# EasyEDA Pro project RCkid.epro, schematic Devboard, sheets 6 to 7 of 7

## Sheets
6 Connectors: Page Name: Connectors
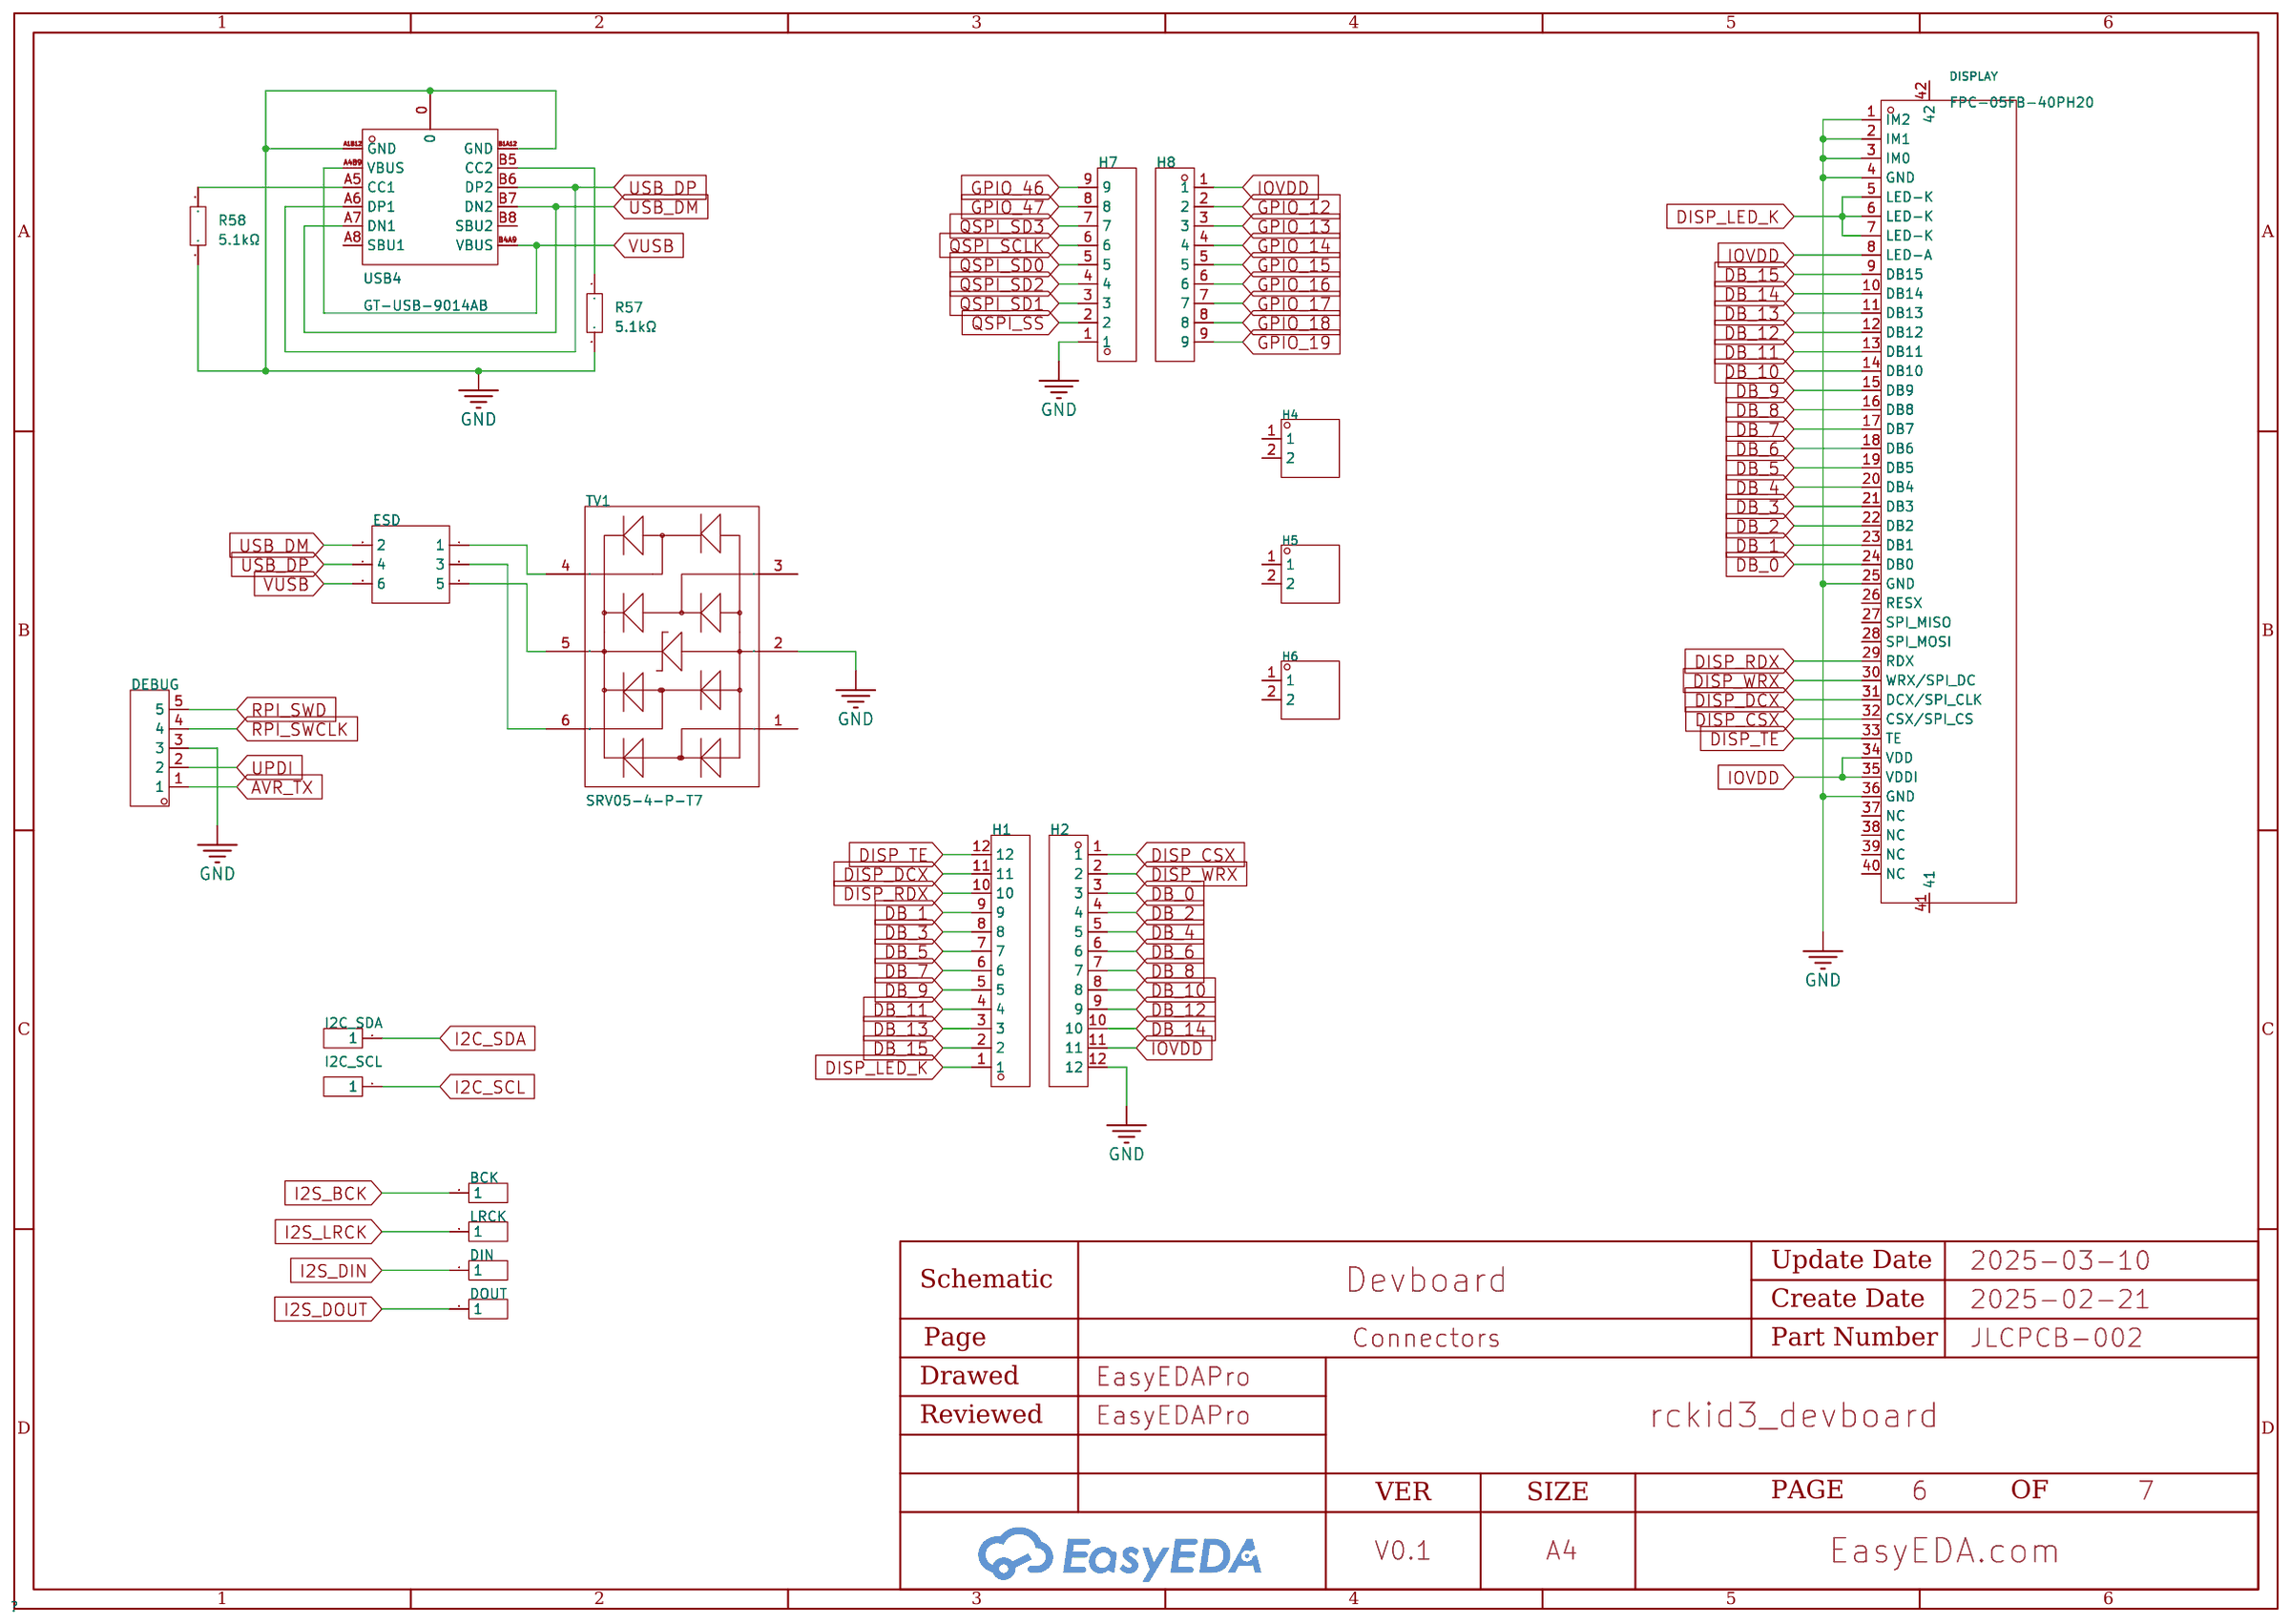
[diagram p20: Connectors]
7 RP2350: Page Name: RP2350; Update Date: 2025-03-01; Version: V1.0
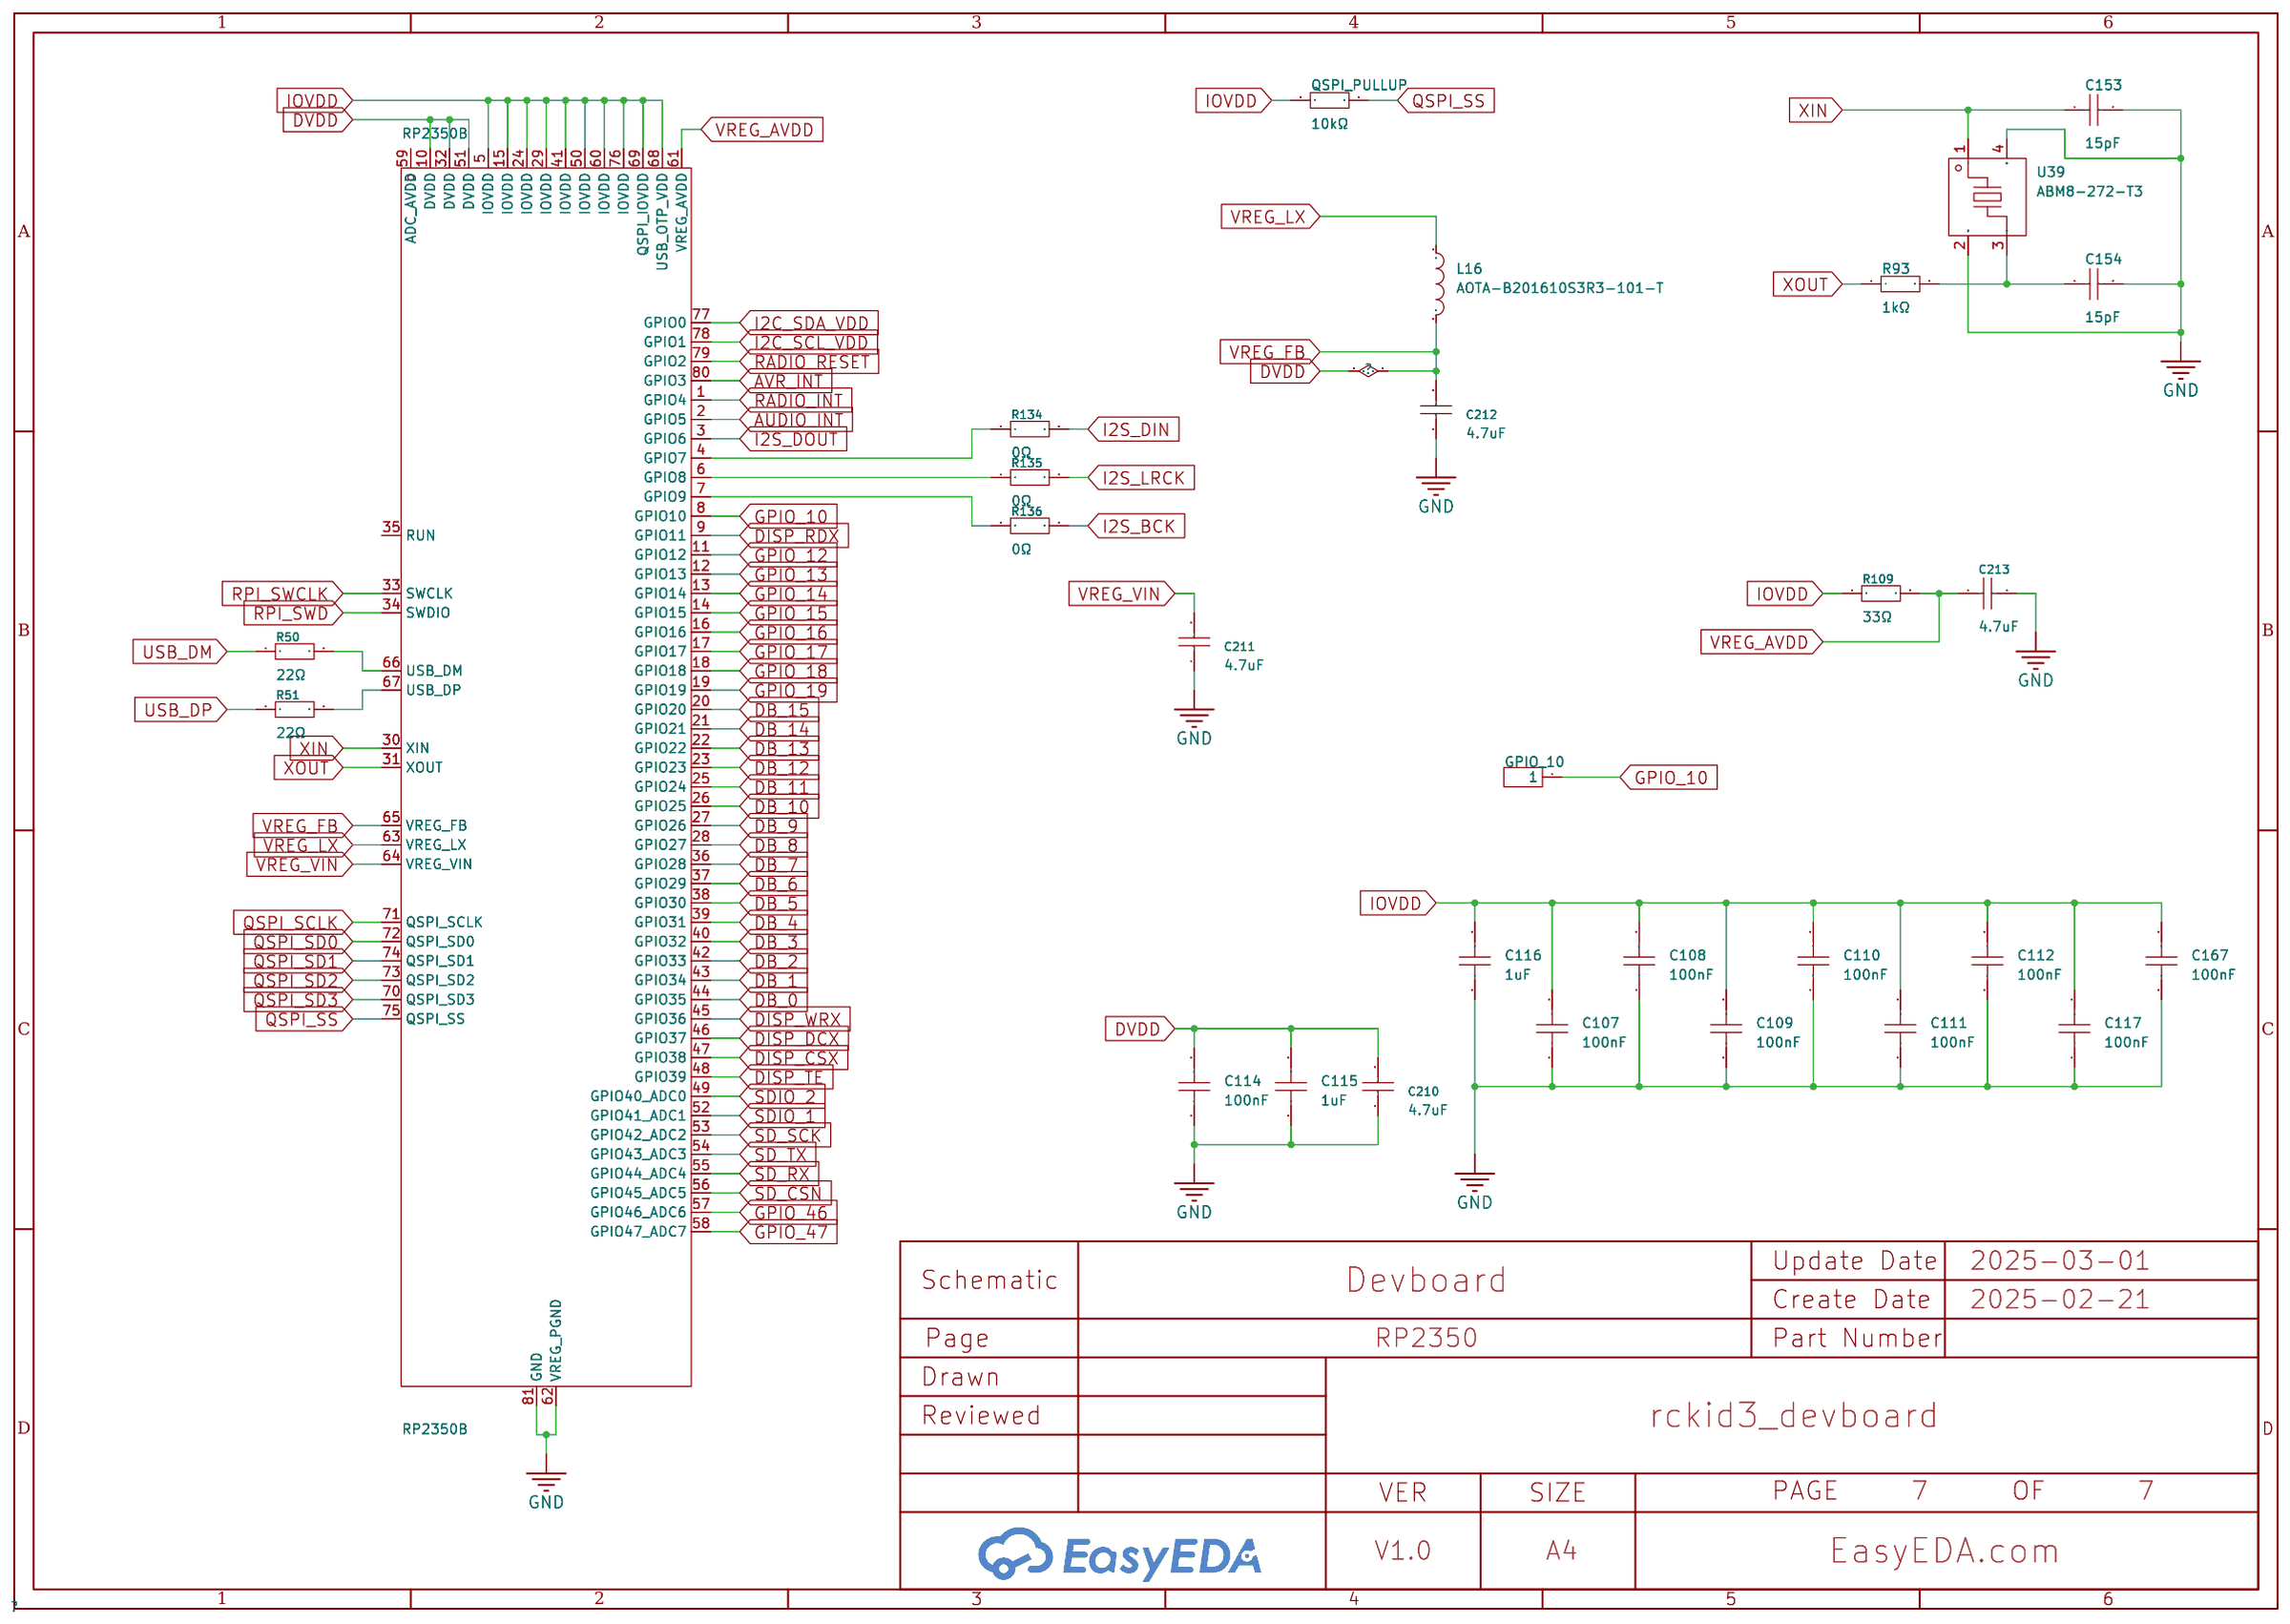
[diagram p21: RP2350]

## Parts
sheet Connectors
BCK  -  [HDR-TH_1P-V-M_XKB_X4611WV-01I-C28D40]
DEBUG  -  [HDR-TH_5P-P2.54-V-M]
DIN  -  [HDR-TH_1P-V-M_XKB_X4611WV-01I-C28D40]
DISPLAY  FPC-05FB-40PH20  [FPC-SMD_40P-P0.50_XUNPU_FPC-05FB-40PH20]
DOUT  -  [HDR-TH_1P-V-M_XKB_X4611WV-01I-C28D40]
ESD  -  [HDR-TH_6P-P2.54-V-F-R2-C3-S2.54]
H1  -  [HDR-TH_12P-P2.54-V-M]
H2  -  [HDR-TH_12P-P2.54-V-M]
H4  -  [HDR-TH_2P-P2.54-V-M-1]
H5  -  [HDR-TH_2P-P2.54-V-M-1]
H6  -  [HDR-TH_2P-P2.54-V-M-1]
H7  -  [HDR-TH_9P-P2.54-V-M]
H8  -  [HDR-TH_9P-P2.54-V-M]
I2C_SCL  -  [HDR-TH_1P-V-M_XKB_X4611WV-01I-C28D40]
I2C_SDA  -  [HDR-TH_1P-V-M_XKB_X4611WV-01I-C28D40]
LRCK  -  [HDR-TH_1P-V-M_XKB_X4611WV-01I-C28D40]
R57  5.1kΩ  [R0402]
R58  5.1kΩ  [R0402]
TV1  SRV05-4-P-T7  [SOT-23-6_L2.9-W1.6-P0.95-LS2.8-BR]
USB4  GT-USB-9014AB  [USB-C-SMD_GT-USB-9014AB]
sheet RP2350
C107  100nF  [C0402]
C108  100nF  [C0402]
C109  100nF  [C0402]
C110  100nF  [C0402]
C111  100nF  [C0402]
C112  100nF  [C0402]
C114  100nF  [C0402]
C115  1uF  [C0402]
C116  1uF  [C0402]
C117  100nF  [C0402]
C153  15pF  [C0402]
C154  15pF  [C0402]
C167  100nF  [C0402]
C210  4.7uF  [C0402]
C211  4.7uF  [C0402]
C212  4.7uF  [C0402]
C213  4.7uF  [C0402]
GPIO_10  -  [HDR-TH_1P-V-M_XKB_X4611WV-01I-C28D40]
L16  AOTA-B201610S3R3-101-T  [IND-SMD_L2.0-W1.6_AOTA-B201610S3R3-101-T]
QSPI_PULLUP  10kΩ  [R0805]
R50  22Ω  [R0402]
R51  22Ω  [R0402]
R93  1kΩ  [R0402]
R109  33Ω  [R0402]
R134  0Ω  [R0805]
R135  0Ω  [R0805]
R136  0Ω  [R0805]
RP2350B  RP2350B  [QFN-80_L10.0-W10.0-P0.40-TL-EP3.4]
U39  ABM8-272-T3  [CRYSTAL-SMD_4P-L3.2-W2.5-BL]

## Library data of the parts
BCK DIN DOUT GPIO_10 I2C_SCL I2C_SDA LRCK = HDR-M_2.54_1x1P: Supplier Footprint: Through
DEBUG = HDR-M_2.54_1x5P: Supplier Footprint: Through
DISPLAY = FPC-05FB-40PH20: Locking Feature:Clamshell Contact Type:Double-sided contacts/up and down connection Number of Contacts:40P Pitch:0.5mm Mounting Type:卧贴 FFC, FCB Thickness:0.3mm FFC, FCB Thickness:0.3mm Height Above Board:2mm Operating Temperature Range:-25℃~+85℃ Operatin; LCSC Part Name: 间距:0.5mm P数:40P 翻盖式 双侧触点/上下接; Supplier Part: C2856837; Manufacturer: XUNPU(讯普); Supplier Footprint: SMD,P=0.5mm,卧贴; JLCPCB Part Class: Extended Part; Datasheet: https://atta.szlcsc.com/upload/public/pdf/source/20210922/C2856837_A0FF02895414764A7F2E525E58748FC4.pdf; Supplier: LCSC; Locking Feature: Clamshell; Contact Type: Double-sided contacts/up and down connection; Number of Contacts: 40P; Pitch: 0.5mm; Mounting Type: 卧贴; FFC, FCB Thickness: 0.3mm; Height Above Board: 2mm; Operating Temperature Range: -25℃~+85℃
ESD = HDR-F-2.54_2x3: Supplier Footprint: Through
H1 H2 = HDR-M_2.54_1x12P: Supplier Footprint: Through
H4-H6 = HDR-M_2.54_1x2P: Supplier Footprint: Through
H7 H8 = HDR-M_2.54-1x9P: Supplier Footprint: Through
R57 R58 = 0402WGF5101TCE: Type:Thick Film Resistors Resistance: Tolerance:±1% Tolerance:±1% Power(Watts): Temperature Coefficient:±100ppm/℃ Temperature Coefficient:±100ppm/℃ Overload Voltage (Max): Operating Temperature Range:-55℃~+155℃ Operating Temperature Range:-55℃~+155℃; LCSC Part Name: 5.1kΩ ±1% 62.5mW; Supplier Part: C25905; Manufacturer: UNI-ROYAL(厚声); Supplier Footprint: 0402; JLCPCB Part Class: Basic Part; Datasheet: https://atta.szlcsc.com/upload/public/pdf/source/20200306/C422600_1E6D84923E4A46A82E41ADD87F860B5C.pdf; Supplier: LCSC; Type: Thick Film Resistors; Tolerance: ±1%; Temperature Coefficient: ±100ppm/℃; Operating Temperature Range: -55℃~+155℃
TV1 = SRV05-4-P-T7_C85364: Reverse Stand-Off Voltage (Vrwm):5V Breakdown Voltage:6V Peak Pulse Current (Ipp)@10/1000μs:1A@8/20us Maximum Clamping Voltage:12V; LCSC Part Name: Vrwm:5V; Supplier Part: C85364; Manufacturer: PROTEK; Supplier Footprint: SOT-23-6; JLCPCB Part Class: Extended Part; Datasheet: https://atta.szlcsc.com/upload/public/pdf/source/20161024/1477288764689.pdf; Supplier: LCSC; Reverse Stand-Off Voltage (Vrwm): 5V; Breakdown Voltage: 6V; Peak Pulse Current (Ipp)@10/1000μs: 1A@8/20us; Maximum Clamping Voltage: 12V
USB4 = GT-USB-9014AB: Connector Type:Type-C Standard:USB 2.0 Gender:Female Mounting Style:Sink panel Number of Contacts:16P Number of Ports:1 Current Rating - Power (Max):5A Rated Voltage (Max):24V Connect-Disconnect Life:10,000 times Center Height:0.83mm Length:7.35mm Core Co; LCSC Part Name: Type-C 母 沉板; Supplier Part: C3019720; Manufacturer: G-Switch(品赞); Supplier Footprint: SMD; JLCPCB Part Class: Extended Part; Datasheet: https://atta.szlcsc.com/upload/public/pdf/source/20220602/958438E31C2552FB2CF65A3DED7DB700.pdf; Supplier: LCSC; Connector Type: Type-C; Standard: USB 2.0; Gender: Female; Mounting Style: Sink panel; Number of Contacts: 16P; Number of Ports: 1; Current Rating - Power (Max): 5A; Rated Voltage (Max): 24V; Connect-Disconnect Life: 10,000 times; Center Height: 0.83mm; Length: 7.35mm; Core Colour: Black; Operating Temperature Range: -40℃~+85℃
C107-C112 C114 C117 C167 = CL05B104KB54PNC: Capacitance: Tolerance:±10% Tolerance:±10% Voltage Rated: Temperature Coefficient:; LCSC Part Name: 100nF ±10% 50V; Supplier Part: C307331; Manufacturer: SAMSUNG(三星); Supplier Footprint: 0402; JLCPCB Part Class: Basic Part; Datasheet: https://atta.szlcsc.com/upload/public/pdf/source/20181009/C307331_222F7C870FD3EA5F46F538B483443886.pdf; Supplier: LCSC; Tolerance: ±10%
C115 C116 = CL05A105KA5NQNC: Capacitance: Tolerance:±10% Tolerance:±10% Voltage Rated: Temperature Coefficient:; LCSC Part Name: 1uF±10%25V; Supplier Part: C52923; Manufacturer: SAMSUNG(三星); Supplier Footprint: 0402; JLCPCB Part Class: BasicPart; Datasheet: https://atta.szlcsc.com/upload/public/pdf/source/20160103/1457707735223.pdf; Supplier: LCSC; Tolerance: ±10%
C153 C154 = 0402CG150J500NT: Capacitance: Tolerance:±5% Tolerance:±5% Voltage Rated: Temperature Coefficient:; LCSC Part Name: 15pF ±5% 50V; Supplier Part: C1548; Manufacturer: FH(风华); Supplier Footprint: 0402; JLCPCB Part Class: Basic Part; Datasheet: https://atta.szlcsc.com/upload/public/pdf/source/20200305/C486355_26A10D38EF8C2A5C37091D0039909270.pdf; Supplier: LCSC; Tolerance: ±5%
C210-C213 = CL05A475MP5NRNC: Capacitance: Tolerance:±20% Tolerance:±20% Voltage Rated: Temperature Coefficient:; LCSC Part Name: 4.7uF±20%10V; Supplier Part: C23733; Manufacturer: SAMSUNG(三星); Supplier Footprint: 0402; JLCPCB Part Class: BasicPart; Datasheet: https://atta.szlcsc.com/upload/public/pdf/source/20160103/1457707710457.pdf; Supplier: LCSC; Tolerance: ±20%
L16 = AOTA-B201610S3R3-101-T: Supplier Part: C42411119; Manufacturer: ABRACON; Supplier Footprint: 0806; JLCPCB Part Class: Extended Part; Datasheet: https://atta.szlcsc.com/upload/public/pdf/source/20241210/8ED7235334351200B2CE75E3CBC0DAAD.pdf; Supplier: LCSC
QSPI_PULLUP = 0805W8F1002T5E: Type:Thick Film Resistors Resistance:10kΩ Tolerance:±1% Tolerance:±1% Power(Watts): Overload Voltage (Max): Temperature Coefficient:±100ppm/℃ Temperature Coefficient:±100ppm/℃ Operating Temperature Range:-55℃~+155℃ Operating Temperature Range:-55℃~+155℃; LCSC Part Name: 10kΩ ±1% 125mW 厚膜电阻; Supplier Part: C17414; Manufacturer: UNI-ROYAL(厚声); Supplier Footprint: 0805; JLCPCB Part Class: Basic Part; Datasheet: https://atta.szlcsc.com/upload/public/pdf/source/20200306/C422600_1E6D84923E4A46A82E41ADD87F860B5C.pdf; Supplier: LCSC; Tolerance: ±1%; Temperature Coefficient: ±100ppm/℃; Type: Thick Film Resistors; Operating Temperature Range: -55℃~+155℃
R50 R51 = 0402WGF220JTCE: Type:Thick Film Resistors Resistance: Tolerance:±1% Tolerance:±1% Power(Watts): Temperature Coefficient:±100ppm/℃ Temperature Coefficient:±100ppm/℃ Overload Voltage (Max): Operating Temperature Range:-55℃~+155℃ Operating Temperature Range:-55℃~+155℃; LCSC Part Name: 厚膜电阻 22Ω ±1% 62.5mW; Supplier Part: C25092; Manufacturer: UNI-ROYAL(厚声); Supplier Footprint: 0402; JLCPCB Part Class: Basic Part; Datasheet: https://atta.szlcsc.com/upload/public/pdf/source/20200306/C422600_1E6D84923E4A46A82E41ADD87F860B5C.pdf; Supplier: LCSC; Type: Thick Film Resistors; Tolerance: ±1%; Temperature Coefficient: ±100ppm/℃; Operating Temperature Range: -55℃~+155℃
R93 = 0402WGF1001TCE: Type:Thick Film Resistors Resistance: Tolerance:±1% Tolerance:±1% Power(Watts): Temperature Coefficient:±100ppm/℃ Temperature Coefficient:±100ppm/℃ Overload Voltage (Max): Operating Temperature Range:-55℃~+155℃ Operating Temperature Range:-55℃~+155℃; LCSC Part Name: 1kΩ±1%62.5mW; Supplier Part: C11702; Manufacturer: UNI-ROYAL(厚声); Supplier Footprint: 0402; JLCPCB Part Class: BasicPart; Datasheet: https://atta.szlcsc.com/upload/public/pdf/source/20200306/C422600_1E6D84923E4A46A82E41ADD87F860B5C.pdf; Supplier: LCSC; Type: ThickFilmResistors; Tolerance: ±1%; Temperature Coefficient: ±100ppm/℃; Operating Temperature Range: -55℃~+155℃
R109 = 0402WGF330JTCE: Type:Thick Film Resistors Resistance:33Ω Tolerance:±1% Tolerance:±1% Power(Watts): Overload Voltage (Max): Temperature Coefficient:±100ppm/℃ Temperature Coefficient:±100ppm/℃ Operating Temperature Range:-55℃~+155℃ Operating Temperature Range:-55℃~+155℃; LCSC Part Name: 33Ω ±1% 62.5mW 厚膜电阻; Supplier Part: C25105; Manufacturer: UNI-ROYAL(厚声); Supplier Footprint: 0402; JLCPCB Part Class: Basic Part; Datasheet: https://atta.szlcsc.com/upload/public/pdf/source/20200306/C422600_1E6D84923E4A46A82E41ADD87F860B5C.pdf; Supplier: LCSC; Type: Thick Film Resistors; Tolerance: ±1%; Temperature Coefficient: ±100ppm/℃; Operating Temperature Range: -55℃~+155℃
R134-R136 = 0805W8F0000T5E_C17477: Type:Thick Film Resistors Resistance: Tolerance:±1% Tolerance:±1% Power(Watts): Overload Voltage (Max): Temperature Coefficient:±800ppm/℃ Temperature Coefficient:±800ppm/℃ Operating Temperature Range:-55℃~+155℃ Operating Temperature Range:-55℃~+155℃; LCSC Part Name: 0Ω ±1% 125mW 厚膜电阻; Supplier Part: C17477; Manufacturer: UNI-ROYAL(厚声); Manufacturer Part: 0805W8F0000T5E; Supplier Footprint: 0805; JLCPCB Part Class: Basic Part; Datasheet: https://atta.szlcsc.com/upload/public/pdf/source/20200306/C422600_1E6D84923E4A46A82E41ADD87F860B5C.pdf; Supplier: LCSC; Type: Thick Film Resistors; Tolerance: ±1%; Temperature Coefficient: ±800ppm/℃; Operating Temperature Range: -55℃~+155℃
RP2350B = RP2350B: Supplier Part: C9900136713; Supplier Footprint: QFN80; Supplier: LCSC
U39 = ABM8-272-T3_C20625731: LCSC Part Name: 推荐配套使用产品C20625731 ABM8-272-T3 与 C2040 RP2040; Supplier Part: C20625731; Manufacturer: ABRACON; Supplier Footprint: SMD3225-4P; JLCPCB Part Class: Extended Part; Datasheet: https://atta.szlcsc.com/upload/public/pdf/source/20240227/A8BE43F636D80F75C9AF5C59EDF21E9A.pdf; Supplier: LCSC

## Nets
DVDD: C114.2 C115.2 C210.2 C212.2 L16.2 RP2350B.10(DVDD) RP2350B.32(DVDD) RP2350B.51(DVDD) RP2350B.65(VREG_FB)
GND: C107.1 C108.1 C109.1 C110.1 C111.1 C112.1 C114.1 C115.1 C116.1 C117.1 C153.2 C154.2 C167.1 C210.1 C211.1 C212.1 C213.2 DEBUG.3 DISPLAY.1(IM2) DISPLAY.2(IM1) DISPLAY.3(IM0) DISPLAY.4(GND) DISPLAY.25(GND) DISPLAY.36(GND) H2.12 H7.1 R57.2 R58.2 RP2350B.62(VREG_PGND) RP2350B.81(GND) TV1.2 U39.2(GND) U39.4(GND) USB4.0 USB4.A1B12(GND) USB4.B1A12(GND) ; also on sheet 1 2 3 4 5
AUDIO_INT: RP2350B.2(GPIO5) ; also on sheet 3
AVR_INT: RP2350B.80(GPIO3) ; also on sheet 4
AVR_TX: DEBUG.1 ; also on sheet 4
DB_0: DISPLAY.24(DB0) H2.3 RP2350B.44(GPIO35)
DB_1: DISPLAY.23(DB1) H1.9 RP2350B.43(GPIO34)
DB_2: DISPLAY.22(DB2) H2.4 RP2350B.42(GPIO33)
DB_3: DISPLAY.21(DB3) H1.8 RP2350B.40(GPIO32)
DB_4: DISPLAY.20(DB4) H2.5 RP2350B.39(GPIO31)
DB_5: DISPLAY.19(DB5) H1.7 RP2350B.38(GPIO30)
DB_6: DISPLAY.18(DB6) H2.6 RP2350B.37(GPIO29)
DB_7: DISPLAY.17(DB7) H1.6 RP2350B.36(GPIO28)
DB_8: DISPLAY.16(DB8) H2.7 RP2350B.28(GPIO27)
DB_9: DISPLAY.15(DB9) H1.5 RP2350B.27(GPIO26)
DB_10: DISPLAY.14(DB10) H2.8 RP2350B.26(GPIO25)
DB_11: DISPLAY.13(DB11) H1.4 RP2350B.25(GPIO24)
DB_12: DISPLAY.12(DB12) H2.9 RP2350B.23(GPIO23)
DB_13: DISPLAY.11(DB13) H1.3 RP2350B.22(GPIO22)
DB_14: DISPLAY.10(DB14) H2.10 RP2350B.21(GPIO21)
DB_15: DISPLAY.9(DB15) H1.2 RP2350B.20(GPIO20)
DISP_CSX: DISPLAY.32(CSX/SPI_CS) H2.1 RP2350B.47(GPIO38)
DISP_DCX: DISPLAY.31(DCX/SPI_CLK) H1.11 RP2350B.46(GPIO37)
DISP_LED_K: DISPLAY.5(LED-K) DISPLAY.6(LED-K) DISPLAY.7(LED-K) H1.1 ; also on sheet 4
DISP_RDX: DISPLAY.29(RDX) H1.10 RP2350B.9(GPIO11)
DISP_TE: DISPLAY.33(TE) H1.12 RP2350B.48(GPIO39)
DISP_WRX: DISPLAY.30(WRX/SPI_DC) H2.2 RP2350B.45(GPIO36)
GPIO_10: GPIO_10.1 RP2350B.8(GPIO10)
GPIO_12: H8.2 RP2350B.11(GPIO12)
GPIO_13: H8.3 RP2350B.12(GPIO13)
GPIO_14: H8.4 RP2350B.13(GPIO14)
GPIO_15: H8.5 RP2350B.14(GPIO15)
GPIO_16: H8.6 RP2350B.16(GPIO16)
GPIO_17: H8.7 RP2350B.17(GPIO17)
GPIO_18: H8.8 RP2350B.18(GPIO18)
GPIO_19: H8.9 RP2350B.19(GPIO19)
GPIO_46: H7.9 RP2350B.57(GPIO46_ADC6)
GPIO_47: H7.8 RP2350B.58(GPIO47_ADC7)
I2C_SCL: I2C_SCL.1 ; also on sheet 1 2 4 5
I2C_SCL_VDD: RP2350B.78(GPIO1) ; also on sheet 2 3
I2C_SDA: I2C_SDA.1 ; also on sheet 1 2 4 5
I2C_SDA_VDD: RP2350B.77(GPIO0) ; also on sheet 2 3
I2S_BCK: BCK.1 R136.2 ; also on sheet 3
I2S_DIN: DIN.1 R134.2 ; also on sheet 3
I2S_DOUT: DOUT.1 RP2350B.3(GPIO6) ; also on sheet 3
I2S_LRCK: LRCK.1 R135.2 ; also on sheet 3
IOVDD: C107.2 C108.2 C109.2 C110.2 C111.2 C112.2 C116.2 C117.2 C167.2 DISPLAY.8(LED-A) DISPLAY.34(VDD) DISPLAY.35(VDDI) H2.11 H8.1 QSPI_PULLUP.2 R109.1 RP2350B.5(IOVDD) RP2350B.15(IOVDD) RP2350B.24(IOVDD) RP2350B.29(IOVDD) RP2350B.41(IOVDD) RP2350B.50(IOVDD) RP2350B.60(IOVDD) RP2350B.68(USB_OTP_VDD) RP2350B.69(QSPI_IOVDD) RP2350B.76(IOVDD) ; also on sheet 1 2 3 4
QSPI_SCLK: H7.6 RP2350B.71(QSPI_SCLK)
QSPI_SD0: H7.5 RP2350B.72(QSPI_SD0)
QSPI_SD1: H7.3 RP2350B.74(QSPI_SD1)
QSPI_SD2: H7.4 RP2350B.73(QSPI_SD2)
QSPI_SD3: H7.7 RP2350B.70(QSPI_SD3)
QSPI_SS: H7.2 QSPI_PULLUP.1 RP2350B.75(QSPI_SS) ; also on sheet 4
RADIO_INT: RP2350B.1(GPIO4) ; also on sheet 3
RADIO_RESET: RP2350B.79(GPIO2) ; also on sheet 3
RPI_SWCLK: DEBUG.4 RP2350B.33(SWCLK)
RPI_SWD: DEBUG.5 RP2350B.34(SWDIO)
SD_CSN: RP2350B.56(GPIO45_ADC5) ; also on sheet 2
SD_RX: RP2350B.55(GPIO44_ADC4) ; also on sheet 2
SD_SCK: RP2350B.53(GPIO42_ADC2) ; also on sheet 2
SD_TX: RP2350B.54(GPIO43_ADC3) ; also on sheet 2
SDIO_1: RP2350B.52(GPIO41_ADC1) ; also on sheet 2
SDIO_2: RP2350B.49(GPIO40_ADC0) ; also on sheet 2
UPDI: DEBUG.2 ; also on sheet 4
USB_DM: ESD.2 R50.1 USB4.A7(DN1) USB4.B7(DN2)
USB_DP: ESD.4 R51.1 USB4.A6(DP1) USB4.B6(DP2)
VREG_AVDD: C213.1 R109.2 RP2350B.61(VREG_AVDD)
VREG_LX: L16.1 RP2350B.63(VREG_LX)
VREG_VIN: C211.2 RP2350B.64(VREG_VIN)
VUSB: ESD.6 USB4.A4B9(VBUS) USB4.B4A9(VBUS) ; also on sheet 1
XIN: C153.1 RP2350B.30(XIN) U39.1
XOUT: R93.1 RP2350B.31(XOUT)
$6N33143: ESD.3 TV1.6
$6N33347: ESD.5 TV1.5
$6N33365: ESD.1 TV1.4
$6N39049: R57.1 USB4.B5(CC2)
$6N39098: R58.1 USB4.A5(CC1)
$7N680: R51.2 RP2350B.67(USB_DP)
$7N687: R50.2 RP2350B.66(USB_DM)
$7N1009: C154.1 R93.2 U39.3
$7N19057: R135.1 RP2350B.6(GPIO8)
$7N19062: R134.1 RP2350B.4(GPIO7)
$7N19069: R136.1 RP2350B.7(GPIO9)

Not connected (* = marked no-connect by the designer): DISPLAY 26(RESX) 27(SPI_MISO) 28(SPI_MOSI) 37(NC) 38(NC) 39(NC) 40(NC) 41 42; H4 1 2; H5 1 2; H6 1 2; RP2350B 35(RUN) 59(ADC_AVDD); TV1 1 3; USB4 A8(SBU1) B8(SBU2)
